# EasyEDA Pro project 1 Port AC Power Switch.eprj, board Single Port PCB
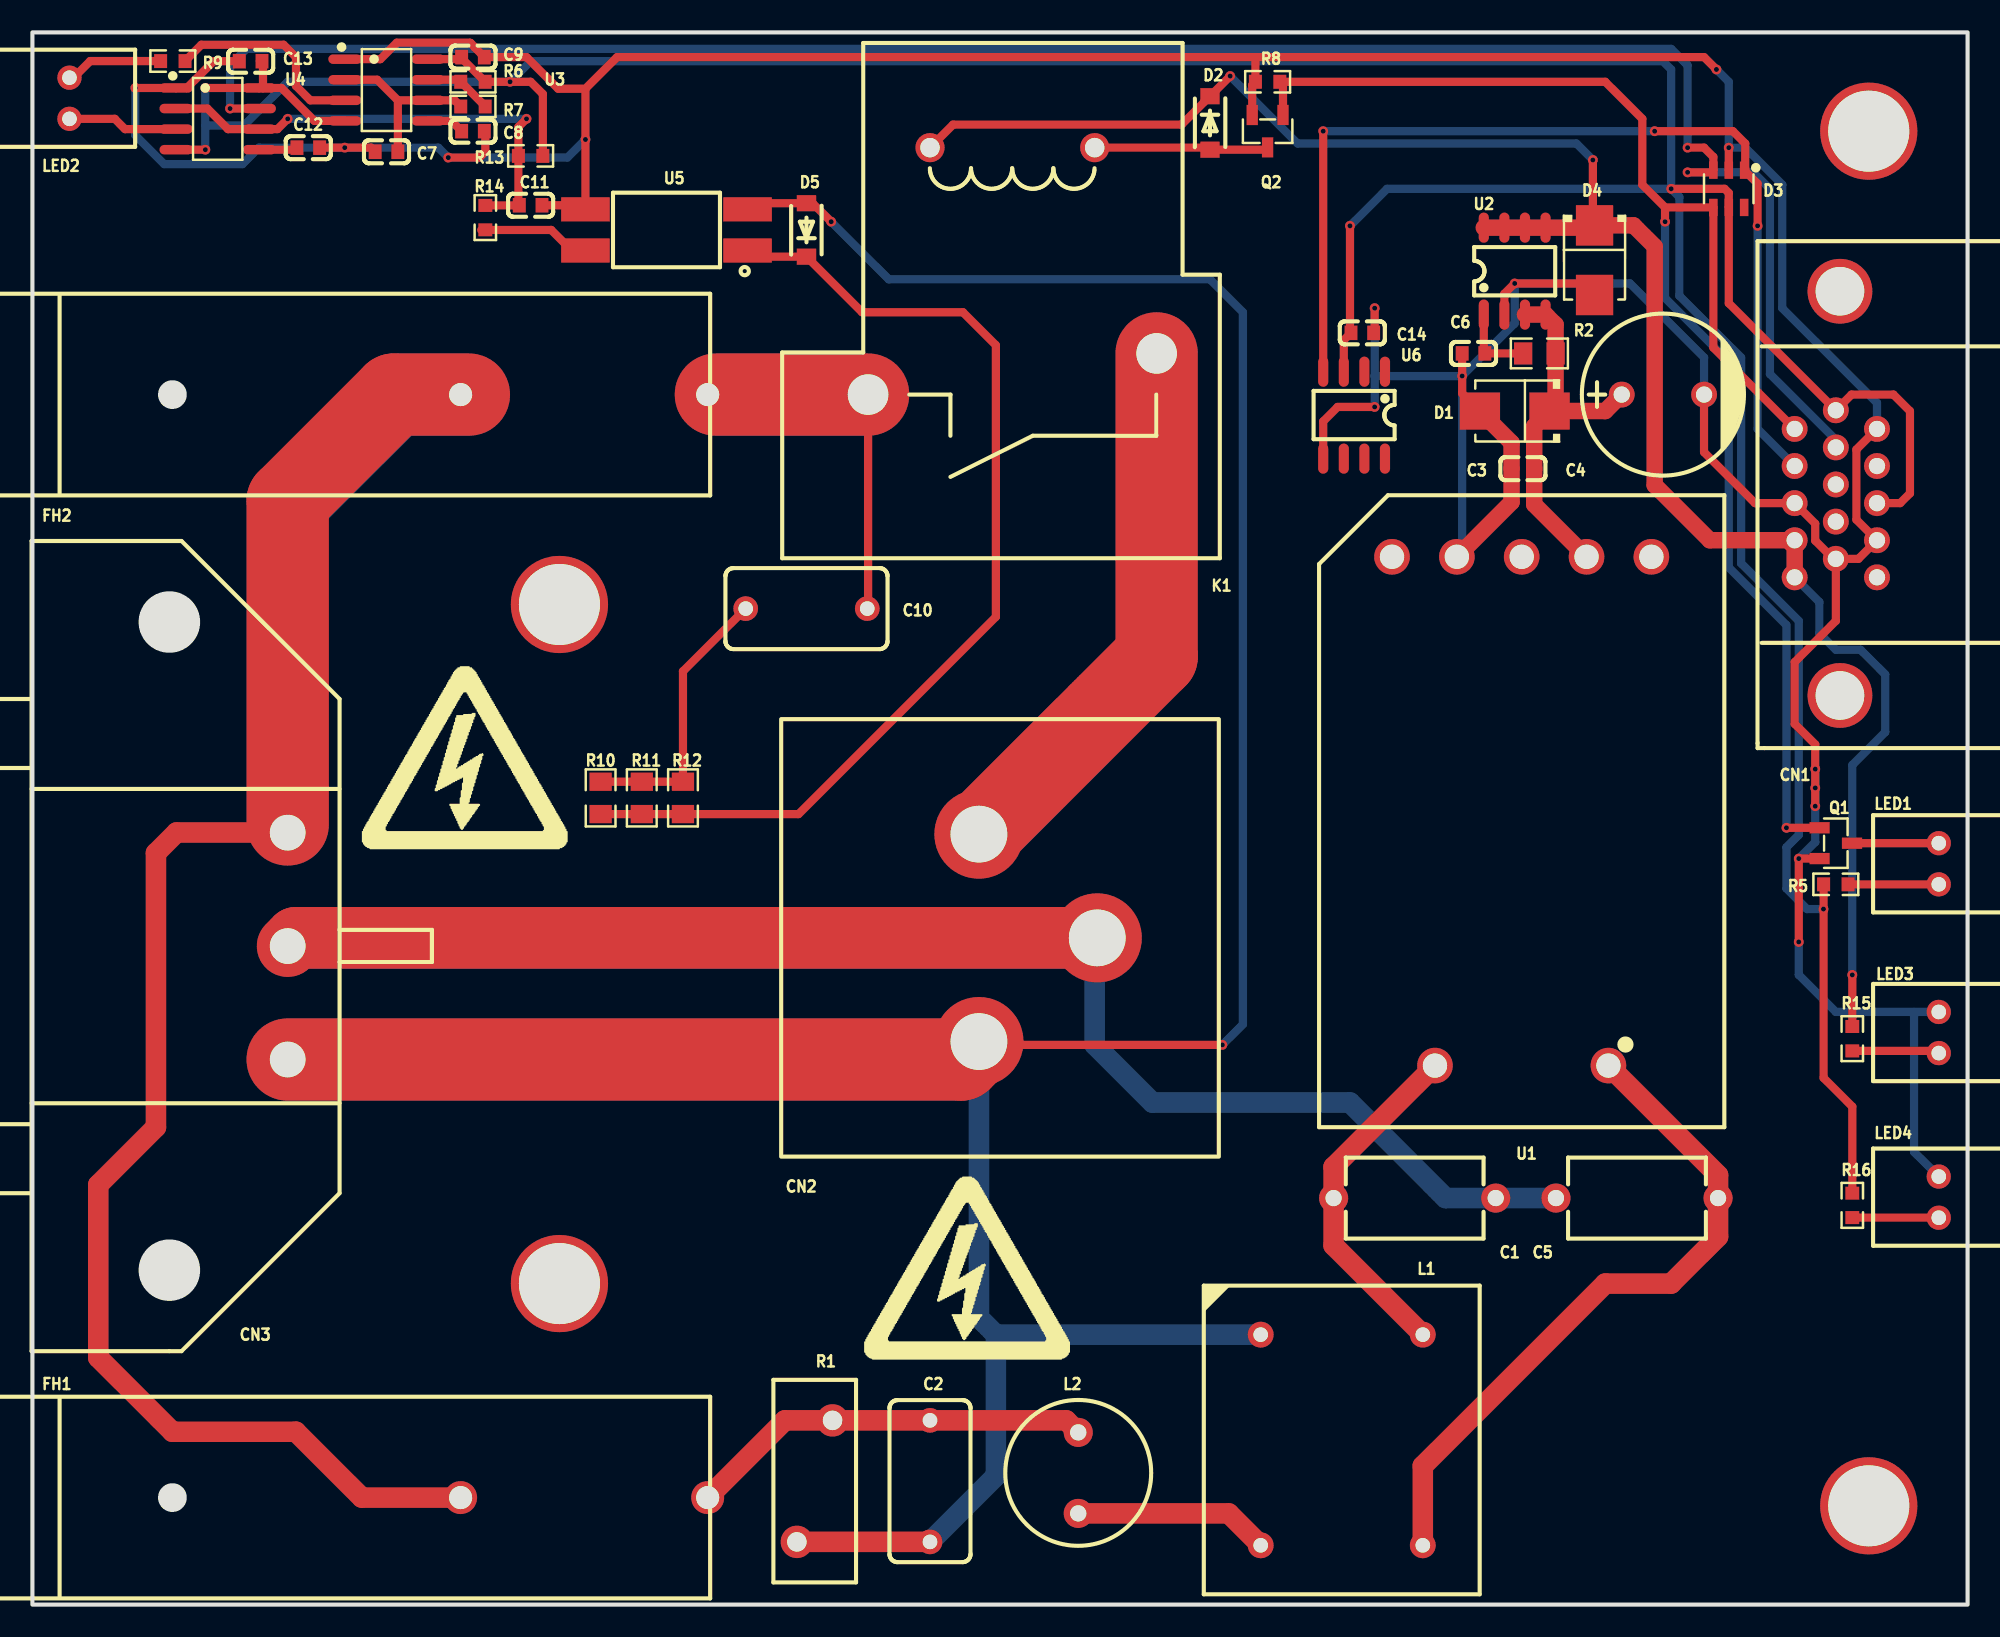
[diagram p10: board, top side]
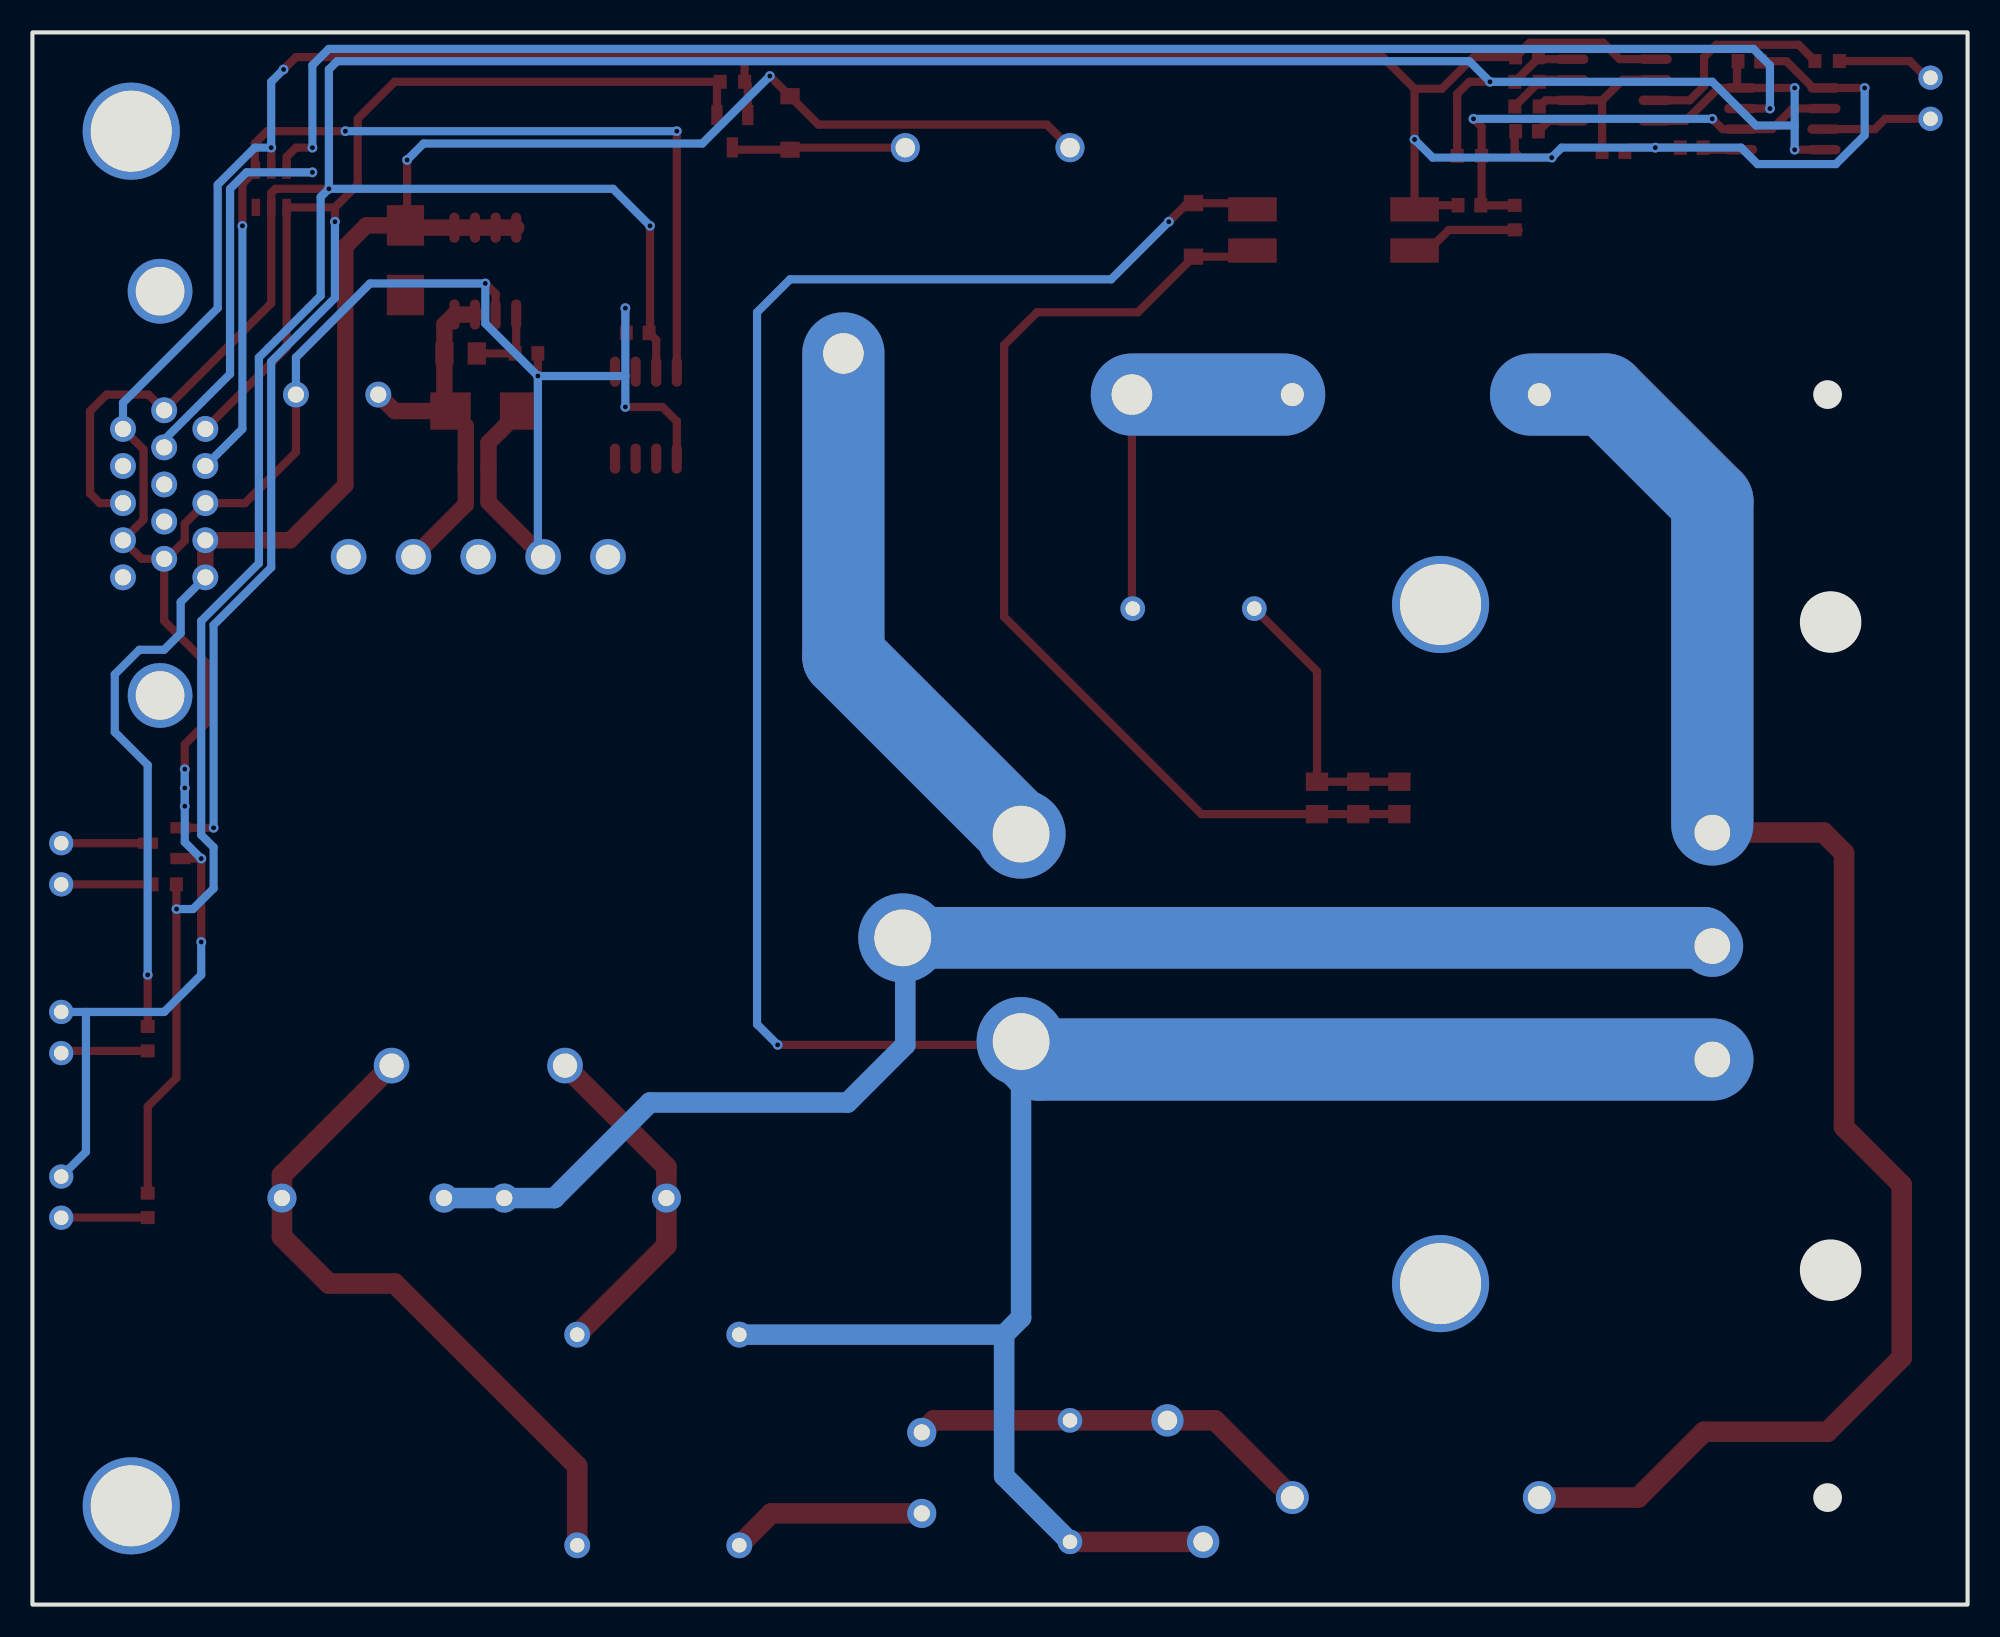
[diagram p11: board, bottom side, seen from below]

Outline 119.38 x 97.03 mm; copper layers: Top Layer, Bottom Layer. Coordinates in mm from the lower left corner of the outline.
Outline path: rectangle 0,97.03 119.38,0
Stack: Top Layer 0.035mm / Dielectric1 1.51mm FR4 er 4.5 / Bottom Layer 0.035mm

## Design rules (mm)
template: Custom Config
spacing copperThickness1oz (default): track to track 0.102, other pairs 0.152 to 0.3
spacing copperThickness2oz: track to track 0.203, other pairs 0.152 to 0.3
track width copperThickness1oz (default): min 0.127, default 0.254, max 7.62
track width copperThickness2oz: min 0.203, default 0.254, max 2.54
differential pair differentialPair (default): width min 0.127, default 0.254, max 2.54; gap min 0.152, default 0.152
via viaSize (default): diameter min 0.5, default 0.61, max 10; hole min 0.3, default 0.305, max 6.3
net EARTH uses HV Space

## Placement (name value [footprint] x y rotation side)
C1  1nF  [CAP-TH_L8.5-W5.0-P10.00-D0.6]  85.27 25.09 180 top
C2  100nF  [CAP-TH_L10.0-W5.0-P7.50-D0.6]  55.37 7.62 270 top
C3  1uF  [C0603]  91.95 70.1 0 top
C4  470uF  [CAP-TH_BD10.0-P5.00-D1.0-FD]  100.58 74.68 0 top
C5  1nF  [CAP-TH_L8.5-W5.0-P10.00-D0.6]  98.99 25.09 180 top
C6  100nF  [C0603]  88.9 77.22 0 top
C7  10uF  [C0603]  21.84 89.66 0 top
C8  100nF  [C0603]  27.18 90.93 180 top
C9  100nF  [C0603]  27.18 95.5 180 top
C10  100nF  [CAP-TH_L10.0-W5.0-P7.50-D0.6]  47.75 61.47 0 top
C11  10uF  [C0603]  30.73 86.36 180 top
C12  100nF  [C0603]  17.02 89.92 180 top
C13  100nF  [C0603]  13.46 95.25 0 top
C14  100nF  [C0603]  82.04 78.49 180 top
CN1  DS1038-15FBNSiA74-0CC  [DSUB-TH_DS1038-15FBNSIA74-0CC]  111.25 68.58 90 top
CN2  a5006310303c48c0bbc049ad0b759426  [739W-X2/32]  65.69 41.15 270 top
CN3  IEC-EW-4  [CONN-TH_IEC-EW-4]  15.75 40.64 90 top
D1  SMBJ15A  [SMB_L4.3-W3.6-LS5.3-RD]  91.44 73.66 180 top
D2  SM4007PL  [SOD-123F_L2.8-W1.8-LS3.7-RD]  72.64 91.44 270 top
D3  SRV05-4A  [SOT-23-6_L2.9-W1.6-P0.95-LS2.9-BL]  104.65 87.38 180 top
D4  SMBJ15A  [SMB_L4.3-W3.6-LS5.3-RD]  96.37 82.97 270 top
D5  SM4007PL  [SOD-123F_L2.8-W1.8-LS3.7-RD]  47.75 84.84 90 top
FH1  -  [03450101H]  34.04 6.6 0 top
FH2  -  [03450101H]  34.04 74.68 0 top
K1  HF2150-1A-12DE  [RELAY-TH_HF2150-1A]  60.45 82.3 180 top
L1  YDUU10.5-253L0321  [IND-TH_4P-L19.0-W17.0]  80.77 10.16 270 top
L2  470uH  [IND-TH_BD9.0-P5.00-D0.7]  64.52 8.13 270 top
LED1  MHK1560CRBTD  [LED-TH_MHK1560UGBTD]  117.6 45.72 90 top
LED2  MHK1560CRBTD  [LED-TH_MHK1560UGBTD]  2.29 92.96 270 top
LED3  MHK1560UGBTD  [LED-TH_MHK1560UGBTD]  117.6 35.31 90 top
LED4  MHK1560UGBTD  [LED-TH_MHK1560UGBTD]  117.6 25.15 90 top
NOREF  -  [Pad_e48]  113.28 6.1 0 top
NOREF#2  -  [Pad_e58]  32.51 19.81 0 top
NOREF#3  -  [Pad_e53]  32.51 61.72 0 top
NOREF#4  -  [Pad_e54]  113.28 90.93 0 top
Q1  AO3400A  [SOT-23-3_L2.9-W1.3-P1.90-LS2.4-BR]  111.25 46.99 180 top
Q2  AO3400A  [SOT-23-3_L2.9-W1.3-P1.90-LS2.4-BR]  76.2 90.93 90 top
R1  210pF@1kHz  [RES-TH_L12.5-W5.1-P7.50-D1.2-S2.20]  48.26 7.62 270 top
R2  390Ω  [R0805]  92.96 77.22 0 top
R5  1kΩ  [R0603]  111.25 44.45 180 top
R6  10kΩ  [R0603]  27.18 93.98 0 top
R7  20kΩ  [R0603]  27.18 92.46 0 top
R8  10kΩ  [R0603]  76.2 93.98 0 top
R9  1kΩ  [R0603]  8.66 95.26 0 top
R10  10kΩ  [R0805]  35.05 49.78 90 top
R11  10kΩ  [R0805]  37.59 49.78 90 top
R12  10kΩ  [R0805]  40.13 49.78 90 top
R13  4.7kΩ  [R0603]  30.73 89.41 0 top
R14  100Ω  [R0603]  27.94 85.6 90 top
R15  4.7kΩ  [R0603]  112.27 34.92 270 top
R16  1kΩ  [R0603]  112.27 24.64 90 top
U1  TAS20-12-W2  [PWRM-TH_4P-L39.0-W25.0_TAS12-15-W2]  91.87 48.96 90 top
U2  MX5052S  [SOP-8_L4.9-W3.9-P1.27-LS6.0-BL]  91.44 82.3 0 top
U3  NE555DR  [SOIC-8_L4.9-W3.9-P1.27-LS6.0-BL]  21.84 93.47 270 top
U4  NE555DR  [SOIC-8_L4.9-W3.9-P1.27-LS6.0-BL]  11.43 91.69 270 top
U5  LTV-817S-TA1-C  [OPTO-SMD-4_L4.6-W6.5-P2.54-LS10.3-BL]  39.12 84.84 90 top
U6  DS18B20Z(UMW)  [SOP-8_L4.9-W3.9-P1.27-LS6.0-BL]  81.53 73.41 180 top

## Footprints (pads in the part's own frame, mm; a bottom-side part is the same pattern mirrored in y, then rotated)
739W-X2/32
  round 5.5 hole 3.5: 1(6.4,-7.3) 2(-6.4,-7.3) 3(0,0)
03450101H
  round 2.032 hole 1.423: 1(7.62,0) 2(-7.62,0)
C0603
  rect 0.8x0.9 smd: 1(-0.7,0) 2(0.7,0)
CAP-TH_BD10.0-P5.00-D1.0-FD
  round 1.6 hole 1: 1(-2.54,0) 2(2.54,0)
CAP-TH_L8.5-W5.0-P10.00-D0.6
  round 1.8 hole 1: 1(-5,0) 2(5,0)
CAP-TH_L10.0-W5.0-P7.50-D0.6
  round 1.524 hole 0.9: 1(-3.75,0) 2(3.75,0)
CONN-TH_IEC-EW-4
  round 3.2 hole 2.2: 1(-7,0) 2(0,0) 3(7,0)
DSUB-TH_DS1038-15FBNSIA74-0CC
  round 1.6 hole 1: 1(3.978,2.54) 2(1.688,2.54) 3(-0.603,2.54) 4(-2.893,2.54) 5(-5.182,2.54) 6(5.128,0) 7(2.837,0) 8(0.548,0) 9(-1.743,0) 10(-4.042,0) 11(3.978,-2.54) 12(1.688,-2.54) 13(-0.603,-2.54) 14(-2.893,-2.54) 15(-5.182,-2.54)
  round 4 hole 3: 16(12.473,-0.254) 17(-12.473,-0.254)
IND-TH_4P-L19.0-W17.0
  round 1.6 hole 0.9: 1(-6.5,-5) 2(6.5,-5) 3(-6.5,5) 4(6.5,5)
IND-TH_BD9.0-P5.00-D0.7
  round 1.8 hole 1: 1(-2.5,0) 2(2.5,0)
LED-TH_MHK1560UGBTD
  round 1.5 hole 0.9: 1(1.27,0) 2(-1.27,0)
OPTO-SMD-4_L4.6-W6.5-P2.54-LS10.3-BL
  rect 1.5x3 smd: 1(-1.27,-5) 2(1.27,-5) 3(1.27,5) 4(-1.27,5)
Pad_e48
  round 6 hole 5x3: 1(0,0)
Pad_e53
  round 6 hole 5x3: 1(0,0)
Pad_e54
  round 6 hole 5x3: 1(0,0)
Pad_e58
  round 6 hole 5x3: 1(0,0)
PWRM-TH_4P-L39.0-W25.0_TAS12-15-W2
  round 2.2 hole 1.5: 1(-15.7,-5.35) 2(-15.7,5.35) 3(15.7,8) 4(15.7,4) 5(15.7,0) 6(15.7,-4) 7(15.7,-8)
R0603
  rect 0.806x0.864 smd: 1(-0.753,0) 2(0.753,0)
R0805
  rect 1.133x1.377 smd: 1(-1,0) 2(1,0)
RELAY-TH_HF2150-1A
  round 1.8 hole 1.2: 1(-5.08,-7.62) 2(5.08,-7.62)
  round 3.5 hole 2.5: 3(8.9,7.62) 4(-8.9,5.08)
RES-TH_L12.5-W5.1-P7.50-D1.2-S2.20
  round 2 hole 1.2: 1(-3.749,1.1) 2(3.749,-1.1)
SMB_L4.3-W3.6-LS5.3-RD
  rect 2.5x2.3 smd: 1(-2.15,0) 2(2.15,0)
SOD-123F_L2.8-W1.8-LS3.7-RD
  rect 1x1.2 smd: 1(-1.65,0) 2(1.65,0)
SOIC-8_L4.9-W3.9-P1.27-LS6.0-BL
  oval 0.588x2.045 smd: 1(-1.905,-2.57) 2(-0.635,-2.57) 3(0.635,-2.57) 4(1.905,-2.57) 5(1.905,2.57) 6(0.635,2.57) 7(-0.635,2.57) 8(-1.905,2.57)
SOP-8_L4.9-W3.9-P1.27-LS6.0-BL
  oval 0.63x1.865 smd: 1(-1.905,-2.683) 2(-0.635,-2.683) 3(0.635,-2.683) 4(1.905,-2.683) 5(1.905,2.683) 6(0.635,2.683) 7(-0.635,2.683) 8(-1.905,2.683)
SOT-23-3_L2.9-W1.3-P1.90-LS2.4-BR
  rect 1.25x0.7 smd: 1(1,-0.95) 2(1,0.95) 3(-1,0)
SOT-23-6_L2.9-W1.6-P0.95-LS2.9-BL
  rect 0.532x1.072 smd: 1(-0.95,-1.149) 2(0,-1.149) 3(0.95,-1.149) 4(0.95,1.149) 5(0,1.149) 6(-0.95,1.149)

## Nets
As in the schematic.

Pads without a net: CN1 8 9 12 15 16 17; D3 6; NOREF 1; NOREF#2 1; NOREF#3 1; NOREF#4 1; U1 3 5 7; U6 1 2 6 7 8

## Via types
v1: diameter 0.61, hole 0.305, Top Layer to Bottom Layer, 36 vias

## Routing (per net, layer and track width the routed paths; a pad name or vN(x,y) marks a point on that pad's centre or on a via; arc(x,y) is an arc through that point)
+5V: length 260.3
  Top Layer w0.508: U3.8 26.35,95.38 C9.2 26.48,95.43 R6.2 v1(29.46,93.98) 30.73,93.98 31.49,93.23 R13.2 ; 14.03,95.25 14.22,95.06 14.22,93.6 ; R16.2 112.27,30.73 110.5,32.5 110.5,42.87 ; v1(101.09,87.38) 104.39,87.38 104.65,87.12 D3.5 104.65,80.31 CN1.6 112.22,74.68 114.81,74.68 115.82,73.66 115.82,68.58 115.22,67.98 CN1.13 ; U6.3 80.9,78.04 C14.2 81.28,78.55 v1(81.28,85.09) ; v1(110.49,42.93) 110.49,42.87 110.5,42.87 ; 19.27,91.57 17.4,91.57 15.37,93.6 14.22,93.6 ; 110.5,42.87 R5.2 ; 14.22,93.6 U4.8 v1(10.67,93.6) ; U4.4 v1(10.67,89.79)
  Bottom Layer w0.508: v1(110.49,42.93) 109.47,42.93 108.2,44.2 108.2,46.74 108.97,47.5 108.97,60.71 105.41,64.26 105.41,76.96 101.6,80.77 101.6,86.87 v1(101.09,87.38) ; v1(101.09,87.38) 101.09,94.74 100.58,95.25 30.73,95.25 v1(29.46,93.98) 15.75,93.98 13.05,91.28 10.67,91.28 ; v1(101.09,87.38) 83.57,87.38 v1(81.28,85.09) ; v1(10.67,89.79) 10.67,91.28 ; 10.67,91.28 v1(10.67,93.6)
+12V: length 118.9
  Top Layer w0.508: K1.2 56.79,91.34 70.89,91.34 D2.1 v1(73.89,94.33) ; v1(96.27,89.15) 96.27,85.22 96.37,85.12 ; R15.1 v1(112.27,38.86)
  Top Layer w1.016: U2.8 U2.7 U2.6 U2.5 96.23,84.98 96.37,85.12 98.78,85.12 100.08,83.82 100.08,69.09 103.48,65.69 CN1.4 CN1.5
  Bottom Layer w0.508: v1(96.27,89.15) 95.25,90.17 78.05,90.17 v1(73.89,94.33) ; CN1.5 110.24,61.87 110.24,59.94 111.25,58.93 112.78,58.93 114.3,57.4 114.3,53.85 112.27,51.82 v1(112.27,38.86)
GND: length 329.7
  Top Layer w0.508: CN1.10 112.64,64.54 CN1.14 112.52,66.96 112.52,71.29 CN1.11 ; CN1.10 111.25,60.71 108.71,58.17 108.71,54.36 109.98,53.09 v1(109.98,51.56) v1(109.98,50.4) v1(109.98,49.27) ; CN1.10 111.1,64.54 109.98,65.66 109.98,66.71 CN1.3 106.27,67.98 103.12,71.12 C4.2 ; C12.1 v1(19.27,89.92) 20.89,89.92 C7.1 ; v1(108.97,40.89) v1(108.97,46.04) Q1.2 ; 96.37,80.82 95.65,81.53 v1(91.44,81.53) 90.81,80.9 U2.2 ; 75.47,95.5 103.12,95.5 v1(103.89,94.74) ; 75.47,95.5 36.07,95.5 34.12,93.55 ; 75.47,95.5 75.45,95.48 R8.1 75.25,93.78 Q2.2 ; v1(82.8,73.91) 80.52,73.91 79.63,73.02 U6.5 ; v1(82.8,80.01) 82.8,78.55 C14.1 ; v1(6.35,93.6) U4.1 9.53,93.6 11.18,95.25 C13.1 ; D1.2 88.2,74.75 v1(88.2,75.82) C6.1 ; 34.12,93.55 v1(34.12,90.42) U5.3 33.86,86.36 C11.1 ; 34.12,93.55 32.43,93.55 30.48,95.5 C9.1 27.28,96.1 27.28,96.12 27.05,96.36 27.02,96.36 26.99,96.39 22.48,96.39 21.46,95.38 U3.1 ; C8.1 27.94,90.87 27.94,89.66 27.58,89.3 v1(25.65,89.3) ; D3.2 v1(104.65,89.92)
  Top Layer w1.016: D1.2 91.25,71.7 C3.1 91.25,68.04 U1.4
  Bottom Layer w0.508: v1(88.2,75.82) 91.44,79.06 v1(91.44,81.53) 98.55,81.53 103.12,76.96 C4.2 ; v1(88.2,75.82) 88.2,64.99 U1.4 ; v1(88.2,75.82) 88.19,75.82 82.8,75.82 ; CN1.11 113.79,74.17 107.95,80.01 107.95,87.63 105.66,89.92 v1(104.65,89.92) 104.65,93.98 v1(103.89,94.74) ; 82.8,75.82 v1(82.8,80.01) ; 82.8,75.82 v1(82.8,73.91) ; 116.08,36.58 111.25,36.58 108.97,38.86 v1(108.97,40.89) ; 116.08,36.58 116.08,27.94 LED4.1 ; 116.08,36.58 LED3.1 ; v1(34.12,90.42) 33,89.3 v1(25.65,89.3) 25.04,89.92 v1(19.27,89.92) 13.97,89.92 12.95,88.9 8.13,88.9 6.35,90.68 v1(6.35,93.6) ; v1(109.98,51.56) v1(109.98,50.4) v1(109.98,49.27) 109.98,47.06 v1(108.97,46.04)
ACCESS: length 93.6
  Top Layer w0.508: CN1.1 103.7,77.57 D3.4 100.72,86.23 ; Q1.1 v1(108.2,47.94) ; 100.72,86.23 v1(100.72,85.34) ; 100.72,86.23 99.31,87.63 99.31,91.69 97.03,93.98 R8.2 77.15,93.78 Q2.1
  Bottom Layer w0.508: v1(108.2,47.94) 108.2,60.45 104.65,64.01 104.65,76.71 100.72,80.64 v1(100.72,85.34)
EARTH: length 141.9
  Top Layer w3.81: CN2.3 16.26,41.15 CN3.2
  Bottom Layer w1.27: CN2.3 65.53,40.99 65.53,34.54 69.09,30.99 81.28,30.99 87.18,25.09 C1.1 C5.2 ; 65.76,39.34 67.56,41.15
  Bottom Layer w3.81: CN3.2 16.26,41.15 CN2.3
FUSEDET: length 32
  Top Layer w0.508: K1.3 51.55,61.52 C10.2
  Top Layer w5.08: K1.3 42.16,74.68
  Bottom Layer w5.08: 42.16,74.68 K1.3
INTERRUPT: length 127.7
  Top Layer w0.508: U4.7 v1(12.19,92.33) ; v1(102.11,88.39) 103.56,88.39 D3.3 103.7,89.34 103.12,89.92 v1(102.11,89.92)
  Bottom Layer w0.508: v1(12.19,92.33) 12.19,95 13.21,96.01 101.09,96.01 102.11,95 v1(102.11,89.92) ; CN1.7 111.25,71.88 107.19,75.95 107.19,87.38 106.17,88.39 v1(102.11,88.39)
LIVE: length 135.1
  Top Layer w1.27: 15.75,48.15 15.25,47.65 8.89,47.65 7.62,46.38 7.62,29.46 4.06,25.91 4.06,15.24 8.64,10.67 16.26,10.67 20.32,6.6 FH1.2
  Top Layer w5.08: 26.92,74.68 22.3,74.68 15.75,68.12 15.75,48.15
  Bottom Layer w5.08: 15.75,48.15 15.75,68.07 22.35,74.68 26.92,74.68
NEUTRAL: length 236.2
  Top Layer w0.508: v1(73.41,34.54) 60.47,34.54 60.26,34.75 ; v1(49.28,85.34) 48.13,86.49 D5.2 44.5,86.49 U5.2
  Top Layer w1.27: R1.2 55.37,3.87
  Top Layer w5.08: CN3.1 57.28,33.64 CN2.1
  Bottom Layer w0.508: v1(73.41,34.54) 74.68,35.81 74.68,79.76 72.64,81.79 52.83,81.79 v1(49.28,85.34)
  Bottom Layer w1.27: CN2.1 58.39,17.71 59.44,16.66 ; 59.44,16.66 59.44,7.93 C2.2 ; 59.44,16.66 L1.1
  Bottom Layer w5.08: CN2.1 57.28,33.64 CN3.1
ONEWIRE: length 62.4
  Top Layer w0.508: v1(100.08,90.93) 104.9,90.93 105.66,90.17 105.66,88.59 D3.1 106.43,87.7 v1(106.43,85.09) ; U6.4 v1(79.63,90.93)
  Bottom Layer w0.508: v1(106.43,85.09) 106.43,72.55 CN1.2 ; v1(79.63,90.93) v1(100.08,90.93)
$1N351: length 68.4
  Top Layer w5.08: K1.4 69.35,58.51 CN2.2
  Bottom Layer w5.08: K1.4 69.35,58.51 CN2.2
$1N604: length 63.9
  Top Layer w0.508: U5.1 44.5,83.19 D5.1 51.18,79.76 57.4,79.76 59.44,77.72 59.44,60.96 47.26,48.78 R12.1 R11.1 R10.1
$1N729: length 7
  Top Layer w0.508: 27.69,84.84 32,84.84 33.27,83.57 U5.4
$1N819: length 30.1
  Top Layer w0.508: R14.2 30.03,86.35 C11.2 29.98,86.41 R13.1 29.98,91.19 v1(30.48,91.69) ; v1(15.75,91.69) 15.11,91.06 U4.6 12.06,91.06 10.8,92.33 U4.2
  Bottom Layer w0.508: v1(15.75,91.69) v1(30.48,91.69)
$1N1030: length 2.4
  Top Layer w0.508: C12.2 16.19,89.79 U4.5
$1N1211: length 5.8
  Top Layer w0.508: 2.54,94.23 3.56,95.26 R9.1
$1N1254: length 6.6
  Top Layer w0.508: 2.54,91.69 5.08,91.69 5.72,91.06 U4.3
$1N1384: length 12.7
  Top Layer w0.508: U3.3 17.14,92.84 16.26,93.73 16.26,95.5 15.49,96.27 10.42,96.27 R9.2
$1N1437: length 2.3
  Top Layer w0.508: 24.41,91.57 25.84,91.57 C8.2
$1N1554: length 11
  Top Layer w0.508: 22.54,92.84 21.27,94.11 19.27,94.11 ; 22.54,92.84 U3.6 26.04,92.84 R7.1 ; 22.54,92.84 22.54,92.83 C7.2
$1N1596: length 4.2
  Top Layer w0.508: R7.2 27.93,92.47 R6.1 26.3,94.11 24.41,94.11
$1N1792: length 10.8
  Top Layer w0.508: Q2.3 76.06,89.79 D2.2 72.52,89.92 K1.1
$1N3074: length 21.5
  Top Layer w1.27: U1.2 80.27,27.01 C1.2 80.27,22.16 L1.3
$1N3080: length 42.3
  Top Layer w1.27: L1.4 85.77,8.56 97.03,19.81 101.09,19.81 103.99,22.71 C5.1 103.99,26.5 U1.1
$1N3148: length 23.2
  Top Layer w1.016: U2.3 U2.4 93.96,78.99 R2.2 93.96,74.03 D1.1 ; D1.1 92.65,72.72 C3.2 92.65,67.89 U1.6 ; D1.1 97.03,73.66 C4.1
$1N3585: length 4.8
  Top Layer w0.508: U2.1 89.53,77.28 C6.2 R2.1
$1N4288: length 5.9
  Top Layer w0.508: R5.1 117.86,44.45
$1N4486: length 5.6
  Top Layer w0.508: Q1.3 117.86,46.99
$1N13836: length 17.4
  Top Layer w0.508: C10.1 40.13,57.6 R12.2 R11.2 R10.2
$1N20815: length 25.1
  Top Layer w1.27: 55.37,11.37 R1.1 46.42,11.37 FH1.1 ; C2.1 63.77,11.37 L2.1
$1N20816: length 12.1
  Top Layer w1.27: L2.2 73.8,5.63 L1.2
$1N22595: length 5.7
  Top Layer w0.508: 118,34.13 117.96,34.17 R15.2
$1N22684: length 5.6
  Top Layer w0.508: R16.1 117.85,23.88 117.86,23.88

## Text on the board
Bottom Silkscreen Layer: Licensed CERN-OHL-S 2.0 | Version 3.0.1 | May 2026 | Access Control AC Power Switch | Jim Heaney, RIT SHED Makerspace
Document Layer: TODO: | Increase voltage spacing between HV and LV zones to match/exceed the din controller | Go for a better aspect ratio - rectangle that is easy to mount? | Better mounting hole position surrounding the plug for tamper prevent | Check, fix the footprint for the CBI LEDs | 0.25" or so | Still try to be smaller than old one
